# EAGLE design cube_board (EAGLE 6.5.0)
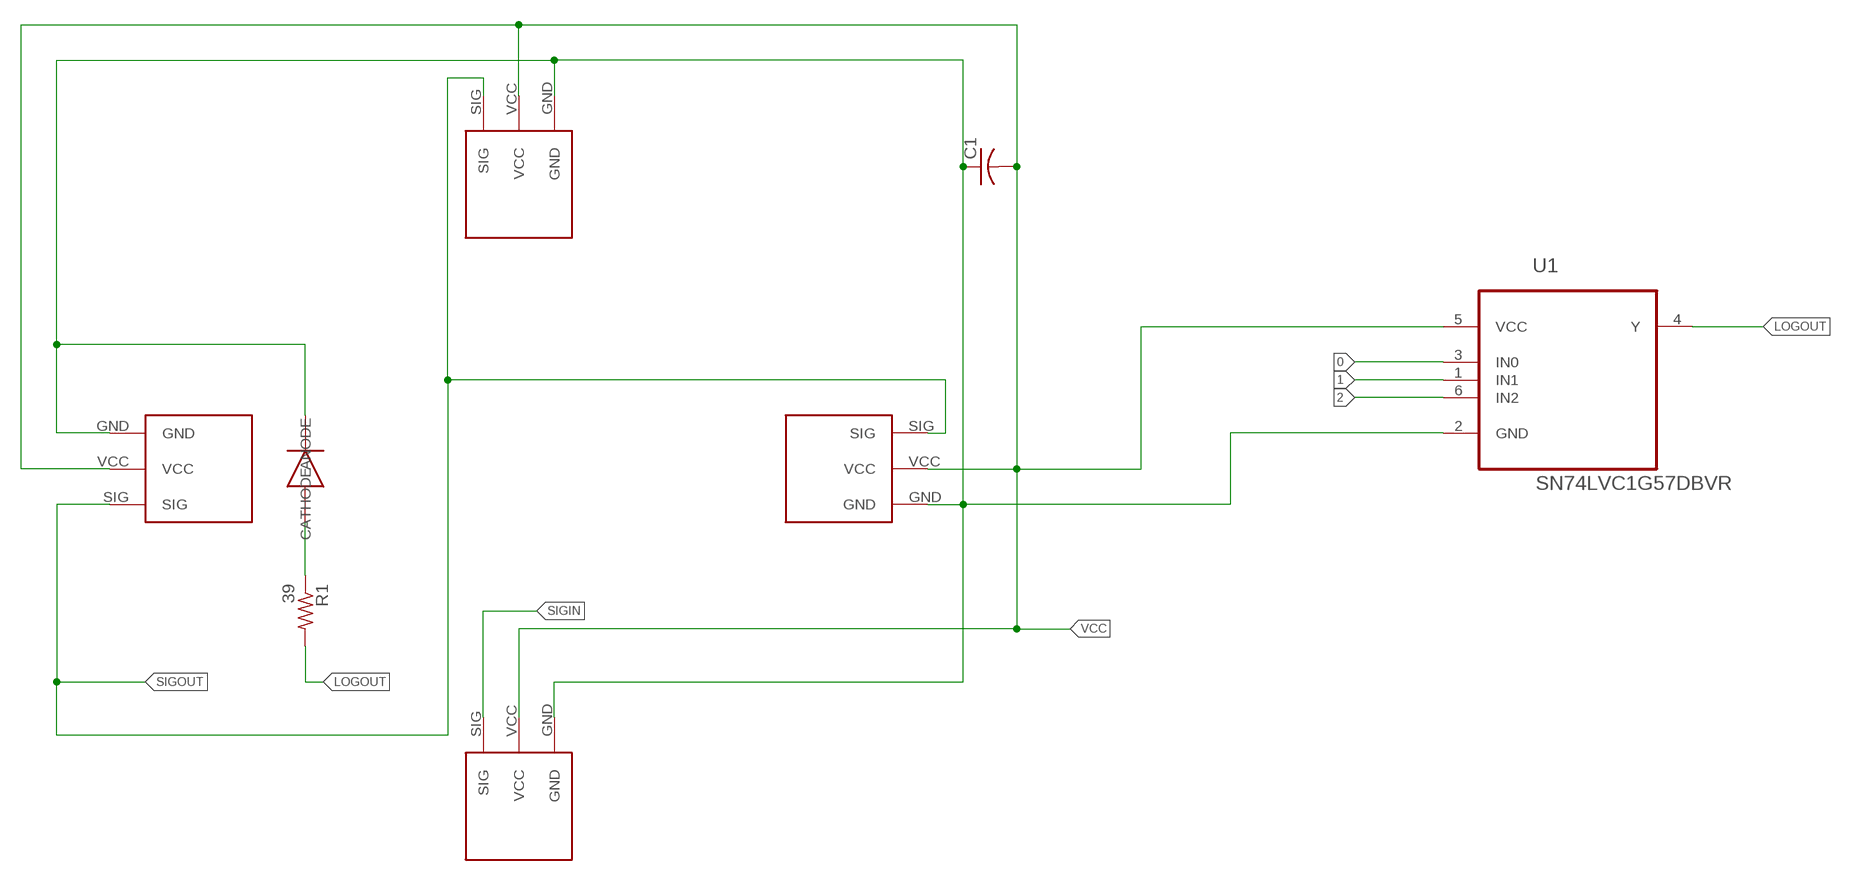
[diagram p0: schematic, sheet 1]

## Parts
C1  C-USC0805  [C0805]
LED  SMD_LED  [SMD_LED]
R1  39  R-US_M1206  [M1206]
U1  SN74LVC1G57DBVR  [SOT95P280X145-6N]
U$2  CUBE_CONNECTOR  [CUBE_CONNECTOR]
U$3  CUBE_CONNECTOR  [CUBE_CONNECTOR]
U$4  CUBE_CONNECTOR  [CUBE_CONNECTOR]
U$5  CUBE_CONNECTOR  [CUBE_CONNECTOR]

## Nets
0: U1.3(IN0)
1: U1.1(IN1)
2: U1.6(IN2)
LOGOUT: R1.2 U1.4(Y)
N$1: LED.ANODE R1.1
N$2: C1.1 LED.CATHODE U1.2(GND) U$2.GND U$3.GND U$4.GND U$5.GND
SIGIN: U$2.SIG
SIGOUT: U$3.SIG U$4.SIG U$5.SIG
VCC: C1.2 U1.5(VCC) U$2.VCC U$3.VCC U$4.VCC U$5.VCC

## Library data of the parts
C1 = rcl:C-US: CAPACITOR, American symbol
LED = Dialight_SMD_LED:SMD_LED
R1 = resistor:R-US_: RESISTOR, American symbol
U1 = TI Multi Function Gate:SN74LVC1G57DBVR: CONFIGURABLE MULTIPLE-FUNCTION GATE; MPN: SN74LVC1G57DBVR; OC_FARNELL: 1470832; OC_NEWARK: 22H0384; PACKAGE: SOT-23-6; SUPPLIER: Texas Instruments
U$2-U$5 = Cube_Connector:CUBE_CONNECTOR

## Board
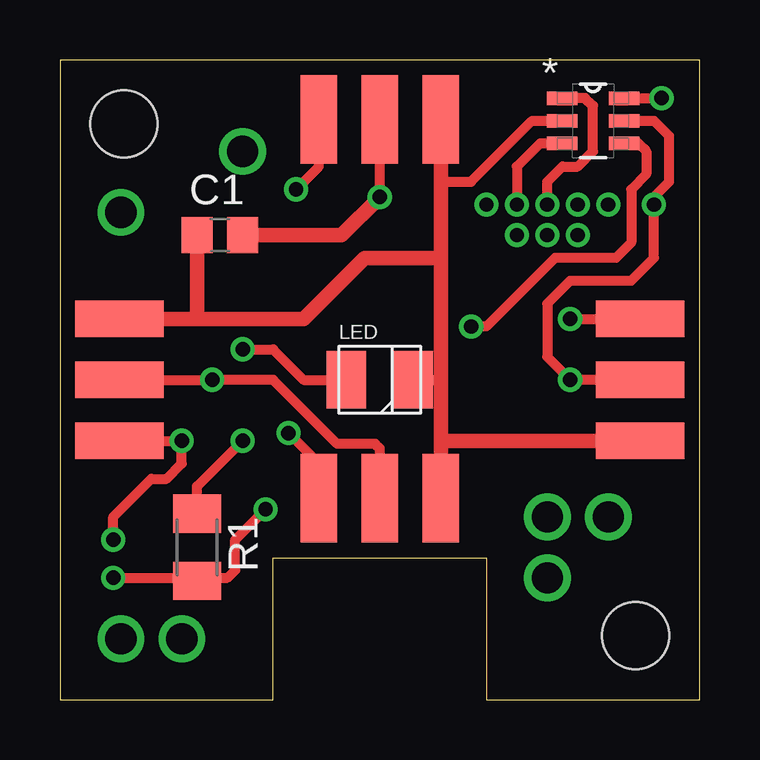
[diagram p1: board, top side]
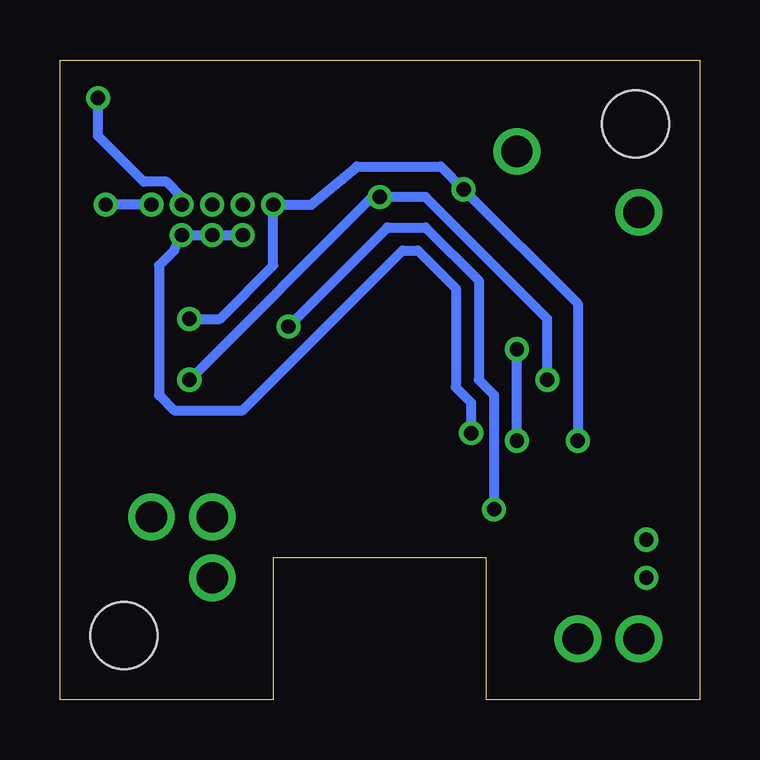
[diagram p2: board, bottom side, seen from below]

Size 26.67 x 26.67 mm. Coordinates in mm from the lower left corner, seen from the top.
Outline: 26.67,0 26.67,26.67 0,26.67 0,0 8.89,0 8.89,5.92 17.78,5.92 17.78,0 26.67,0
Copper layers (1*16): Top 0.035mm / dielectric 1.5mm / Bottom 0.035mm
Design rules "default": minimum track width 10mil, minimum drill 24mil, track to track 8mil, track to pad 8mil, pad to pad 8mil, via to via 8mil, smd to smd 8mil, copper to edge 40mil, drill to drill 8mil, minimum pad ring 10mil, minimum via ring 8mil, stop-mask expansion 4mil, vias tented up to drill 0mil, thermal gap 10mil
Holes 2.8 mm at 2.67,24 24,2.67

### Footprints (pad centres in the part's own frame; a part is rotated, then mirrored left to right if it is on the bottom)
C0805 = smd 1.3 x 1.5: 1 -0.95,0; 2 0.95,0
SMD_LED = smd 2.41 x 1.65: ANODE 0,-1.398; CATHODE 0,1.398
M1206 = smd 1.6 x 2: 1 -1.4,0; 2 1.4,0
SOT95P280X145-6N = smd 1.27 x 0.559: 1 -1.295,0.94; 2 -1.295,0; 3 -1.295,-0.94; 4 1.295,-0.94; 5 1.295,0; 6 1.295,0.94
CUBE_CONNECTOR = smd 1.524 x 3.683: GND 2.54,0; SIG -2.54,0; VCC 0,0

### Placement (x,y rotation side)
C1  6.67,19.37 0 top
LED  13.34,13.34 270 top
R1  5.71,6.35 270 top
U1  22.23,24.13 0 top
U$2  13.34,8.39 0 top
U$3  13.34,24.19 0 top
U$4  2.48,13.34 90 top
U$5  24.19,13.34 270 top

### Tracks (layer width: path | path; a pad name or v marks a point on that pad's centre or on a via)
0  (via drill 0.6)
  Top 0.406: U1.3 20.02,23.19 19.05,22.23 v19.05,20.64
1  (via drill 0.6)
  Top 0.406: U1.1 21.89,25.08 22.23,24.77 22.23,22.86 21.59,22.23 20.95,22.23 20.32,21.59 v20.32,20.64
2  (via drill 0.6)
  Top 0.406: U1.6 24.75,25.07 v25.08,25.08
  Bottom 0.406: v25.08,25.08 25.08,23.5 23.18,21.59 22.23,21.59 21.59,20.95 v21.59,20.64
LOGOUT  (via drill 0.6)
  Top 0.406: v17.14,15.56 17.78,15.56 20.64,18.41 23.18,18.41 23.81,19.05 23.81,21.27 24.45,21.91 24.45,22.86 24.12,23.19 U1.4 | v2.22,5.08 5.58,5.08 R1.2 5.84,5.08 6.99,5.08 7.3,5.4 7.3,6.67 v8.57,7.94
  Bottom 0.406: v17.14,15.56 13.02,19.68 11.43,19.68 9.21,17.46 9.21,13.34 8.57,12.7 v8.57,7.94
N$1  (via drill 0.6)
  Top 0.406: R1.1 5.71,8.89 v7.62,10.79 | v7.62,14.61 8.89,14.61 10.16,13.34 LED.ANODE
  Bottom 0.406: v7.62,10.79 v7.62,14.61
N$2
  Top 0.406: 15.88,21.59 17.14,21.59 19.68,24.13 U1.2 | LED.CATHODE 15.88,13.34
  Top 0.61: 15.88,18.41 15.88,21.59 U$3.GND | U$2.GND 15.88,10.79 | 15.88,10.79 15.88,13.34 15.88,18.41 | U$5.GND 15.88,10.79 | 15.88,18.41 12.7,18.41 10.16,15.88 5.71,15.88 | 5.71,15.88 U$4.GND | C1.1 5.72,15.88 5.71,15.88
N$3  (via drill 1.3)
  other vias: 20.32,7.62 7.62,22.86 2.54,20.32
N$4  (via drill 1.3)
  other vias: 22.86,7.62
N$5  (via drill 1.3)
  other vias: 20.32,5.08
N$6  (via drill 1.3)
  other vias: 2.54,2.54
N$7  (via drill 1.3)
  other vias: 5.08,2.54
SIGIN  (via drill 0.6)
  Top 0.406: U$2.SIG 10.79,9.84 v9.53,11.11
  Bottom 0.406: v9.53,11.11 9.53,12.38 10.16,13.02 10.16,17.14 11.75,18.73 12.38,18.73 19.05,12.06 21.91,12.06 22.54,12.7 22.54,18.1 21.91,18.73 v21.59,19.37 v20.32,19.37 v19.05,19.37
SIGOUT  (via drill 0.6)
  Top 0.406: U$4.SIG v5.08,10.79 5.08,9.84 4.45,9.21 3.81,9.21 2.22,7.62 v2.22,6.67 | v21.27,15.88 U$5.SIG | v9.84,21.27 10.79,22.23 U$3.SIG
  Bottom 0.406: v5.08,10.79 5.08,16.51 v9.84,21.27 10.79,22.23 14.29,22.23 16.19,20.64 v17.78,20.64 17.78,18.1 20,15.88 v21.27,15.88
VCC  (via drill 0.6)
  Top 0.406: U$2.VCC 13.34,10.48 13.14,10.67 11.56,10.67 8.89,13.34 v6.35,13.34 U$4.VCC | U$5.VCC v21.27,13.34 20.32,14.29 20.32,16.51 21.27,17.46 23.81,17.46 24.77,18.41 v24.77,20.64 24.77,20.95 25.4,21.59 25.4,23.5 24.77,24.13 U1.5 | v13.34,20.95 U$3.VCC
  Top 0.61: U$2.VCC 13.34,8.26 | C1.2 11.75,19.37 v13.34,20.95
  Bottom 0.406: v6.35,13.34 6.35,15.88 11.43,20.95 v13.34,20.95 13.65,20.95 v21.27,13.34 | v22.86,20.64 v24.77,20.64